# Altium schematic sheet rp3a0-mini-wireless-sd.SchDoc
size A4; SheetNumber: 5; SheetTotal: 6
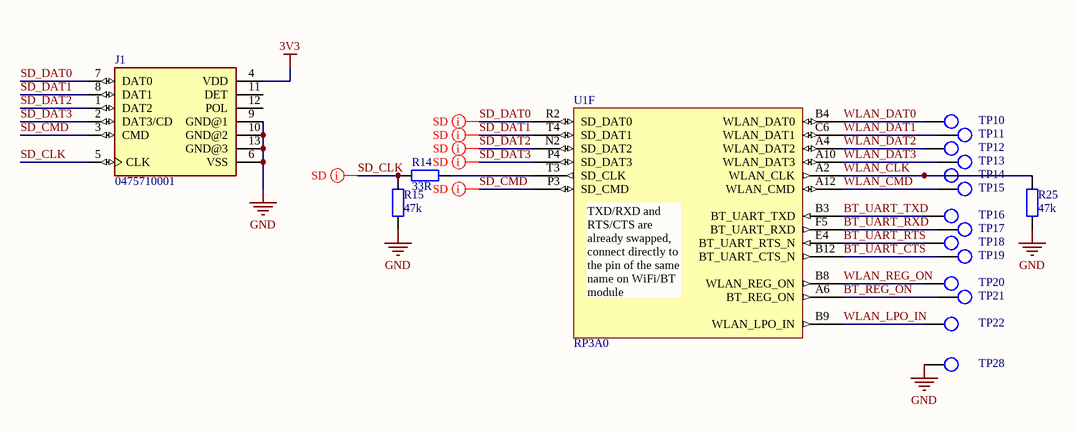
[diagram p0: rp3a0-mini-wireless-sd.SchDoc]

## Parts
J1  0475710001  [MOLEX_0475710001]
R14  value 33R  [RES-0402-SML]  (hidden comment: Res SMD)
R15  value 47k  [RES-0402-SML]  (hidden comment: Res SMD)
R25  value 47k  [RES-0402-SML]  (hidden comment: Res SMD)
TP10  TEST_POINT  [TEST_POINT_1.2MM]  (value not drawn)
TP11  TEST_POINT  [TEST_POINT_1.2MM]  (value not drawn)
TP12  TEST_POINT  [TEST_POINT_1.2MM]  (value not drawn)
TP13  TEST_POINT  [TEST_POINT_1.2MM]  (value not drawn)
TP14  TEST_POINT  [TEST_POINT_1.2MM]  (value not drawn)
TP15  TEST_POINT  [TEST_POINT_1.2MM]  (value not drawn)
TP16  TEST_POINT  [TEST_POINT_1.2MM]  (value not drawn)
TP17  TEST_POINT  [TEST_POINT_1.2MM]  (value not drawn)
TP18  TEST_POINT  [TEST_POINT_1.2MM]  (value not drawn)
TP19  TEST_POINT  [TEST_POINT_1.2MM]  (value not drawn)
TP20  TEST_POINT  [TEST_POINT_1.2MM]  (value not drawn)
TP21  TEST_POINT  [TEST_POINT_1.2MM]  (value not drawn)
TP22  TEST_POINT  [TEST_POINT_1.2MM]  (value not drawn)
TP28  TEST_POINT  [TEST_POINT_1.2MM]  (value not drawn)
U1  RP3A0  [RP3A0-BGA]  (part F of 8)

## Nets
3V3: J1.4(VDD)
GND: J1.6(VSS) J1.9(GND@1) J1.10(GND@2) J1.13(GND@3) R15.1 R25.1 TP28.TP
BT_REG_ON: TP21.TP U1.A6(BT_REG_ON)
BT_UART_CTS: TP19.TP U1.B12(BT_UART_CTS_N)
BT_UART_RTS: TP18.TP U1.E4(BT_UART_RTS_N)
BT_UART_RXD: TP17.TP U1.F5(BT_UART_RXD)
BT_UART_TXD: TP16.TP U1.B3(BT_UART_TXD)
SD_CLK: J1.5(CLK) R14.1 R15.2
SD_CMD: J1.3(CMD) U1.P3(SD_CMD)
SD_DAT0: J1.7(DAT0) U1.R2(SD_DAT0)
SD_DAT1: J1.8(DAT1) U1.T4(SD_DAT1)
SD_DAT2: J1.1(DAT2) U1.N2(SD_DAT2)
SD_DAT3: J1.2(DAT3/CD) U1.P4(SD_DAT3)
WLAN_CLK: R25.2 TP14.TP U1.A2(WLAN_CLK)
WLAN_CMD: TP15.TP U1.A12(WLAN_CMD)
WLAN_DAT0: TP10.TP U1.B4(WLAN_DAT0)
WLAN_DAT1: TP11.TP U1.C6(WLAN_DAT1)
WLAN_DAT2: TP12.TP U1.A4(WLAN_DAT2)
WLAN_DAT3: TP13.TP U1.A10(WLAN_DAT3)
WLAN_LPO_IN: TP22.TP U1.B9(WLAN_LPO_IN)
WLAN_REG_ON: TP20.TP U1.B8(WLAN_REG_ON)
NetR14_2: R14.2 U1.T3(SD_CLK)

Not connected (* = marked no-connect by the designer): J1 11(DET) 12(POL)

## Layout directives
mark named SD: SD_CLK, SD_CMD, SD_DAT0, SD_DAT1, SD_DAT2, SD_DAT3

## Notes on the sheet
- (in symbol RP3A0, part F) TXD/RXD and RTS/CTS are already swapped, connect directly to the pin of the same name on WiFi/BT module

## Library data of the parts
J1 = 0475710001: 9 _8 + 1_ Position Card Connector Secure Digital - microSDâ„¢ Surface Mount, Right Angle Gold; MF: Molex; MP: 0475710001; Package: None; Price: None; Value: *; SnapEDA_Link: https://www.snapeda.com/parts/0475710001/Molex/view-part/424368/?ref=snap; Availability: Unavailable
R14 R15 R25 = Res SMD: Resistor
TP10-TP22 TP28 = TEST_POINT: Test point